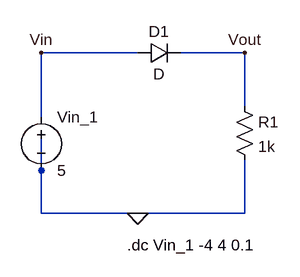
[diagram p0: schematic Draft1.asc]
Draft1.asc, the LTspice schematic file:
Version 4
SHEET 1 880 680
WIRE 80 128 -64 128
WIRE 240 128 144 128
WIRE 240 208 240 128
WIRE -64 224 -64 128
WIRE -64 304 -64 256
WIRE -64 368 -64 304
WIRE 80 368 -64 368
WIRE 240 368 240 288
WIRE 240 368 80 368
FLAG 80 368 0
FLAG -64 128 Vin
FLAG 240 128 Vout
SYMBOL res 224 192 R0
SYMATTR InstName R1
SYMATTR Value 1k
SYMBOL diode 80 144 R270
WINDOW 0 32 32 VTop 2
WINDOW 3 0 32 VBottom 2
SYMATTR InstName D1
SYMBOL voltage -64 208 R0
WINDOW 123 0 0 Left 0
WINDOW 39 0 0 Left 0
SYMATTR InstName Vin_1
SYMATTR Value 5
TEXT 64 416 Left 2 !.dc Vin_1 -4 4 0.1

The netlist it stands for:
* Draft1.asc
R1 Vout 0 1k
D1 Vin Vout D
Vin_1 Vin 0 5
.model D D
.lib standard.dio
.dc Vin_1 -4 4 0.1
.backanno
.end

* Results of the author's LTspice run, read from the files saved beside the schematic
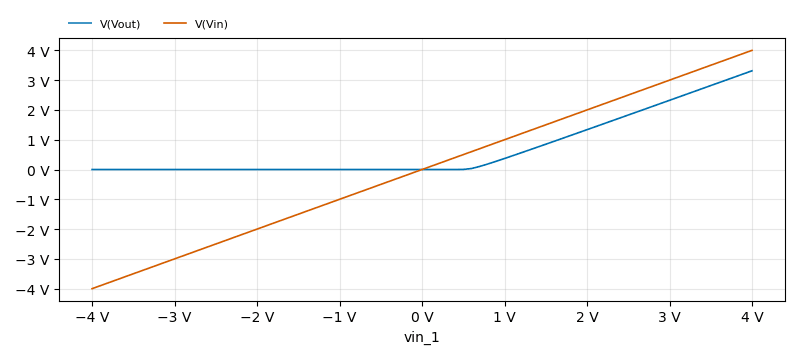
[diagram p1: DC transfer characteristic of Draft1.asc, plotted from the saved traces]
* DC transfer characteristic, 1 run:
*   V(Vout): -4.01 nV at vin_1=-4 V, 3.314 V at vin_1=4 V, min -4.01 nV, max 3.314 V
*   V(Vin): -4 V at vin_1=-4 V, 4 V at vin_1=4 V, min -4 V, max 4 V